# Altium schematic sheet USB_UART.SchDoc
size A4; SheetNumber: 7; SheetTotal: 7
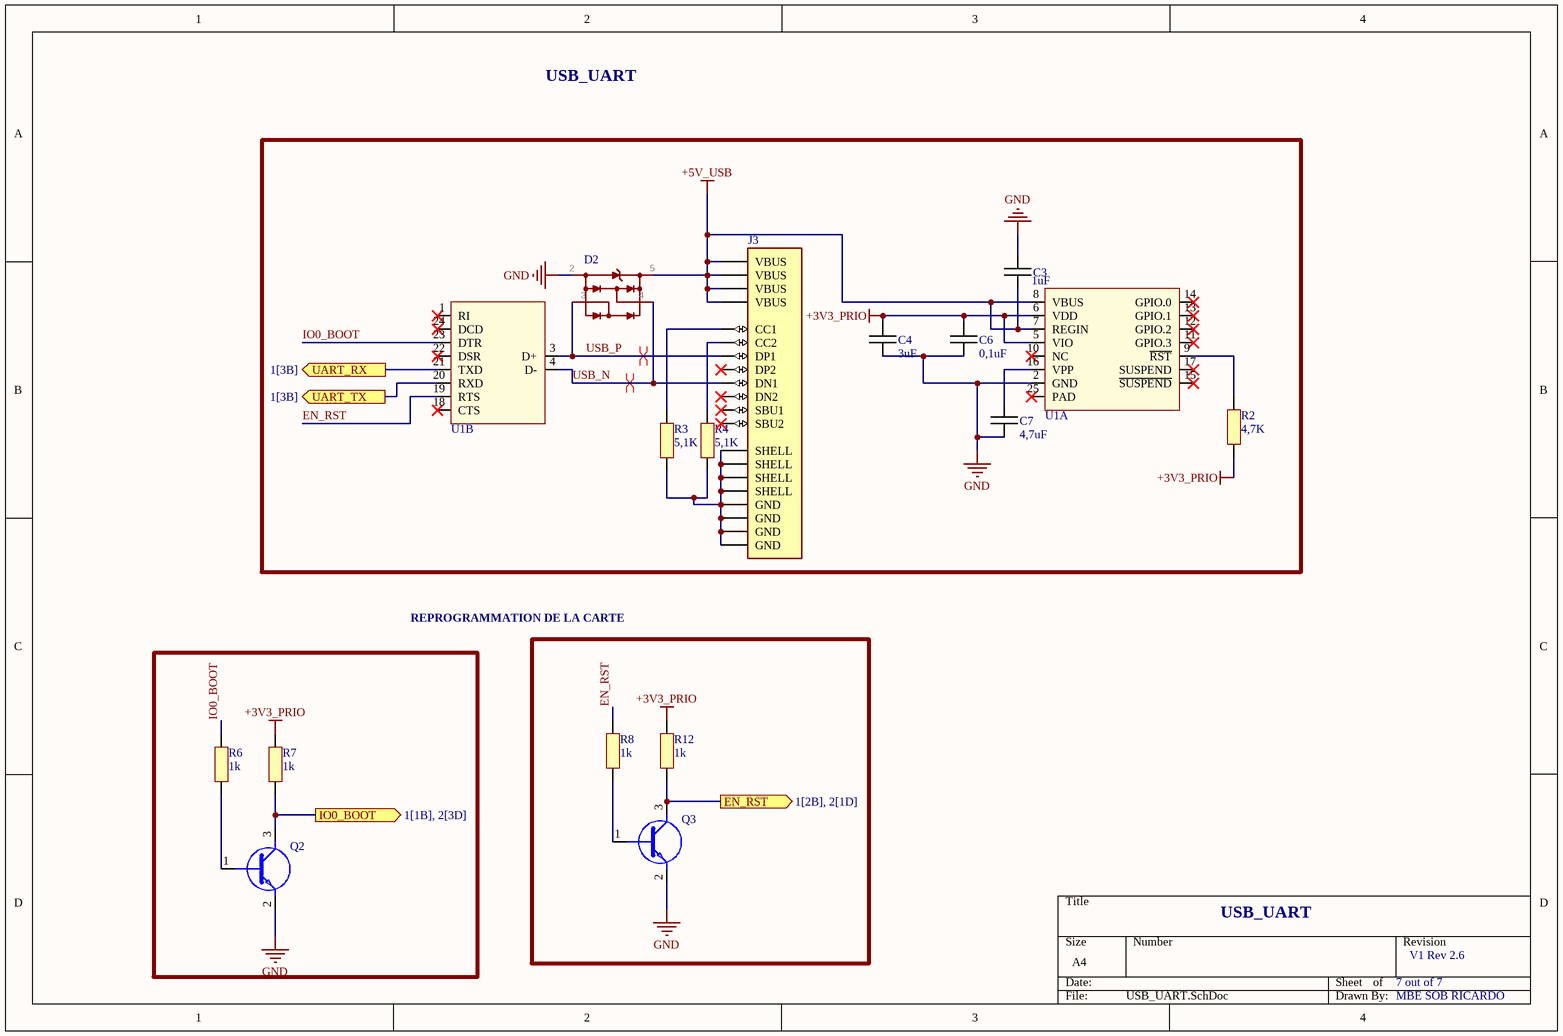
[diagram p0: USB_UART.SchDoc]

## Parts
C3  1uF  [CAPC1005X06N]
C4  3uF  [CAPC1005X06N]
C6  0,1uF  [CAPC1005X06N]
C7  4,7uF  [CAPC1005X06N]
D2  824011  [824011]  (value not drawn)
J3  Use  [USB4085-GF-A]  (value not drawn)
Q2  SS8050-G  [SS8050-G]  (value not drawn)
Q3  SS8050-G  [SS8050-G]  (value not drawn)
R2  4,7K  [RESC1005X06N]
R3  5,1K  [RESC1005X06N]
R4  5,1K  [RESC1005X06N]
R6  1k  [RESC1005X06N]
R7  1k  [RESC1005X06N]
R8  1k  [RESC1005X06N]
R12  1k  [RESC1005X06N]
U1  CP2104-F03-GM  [PQFN50P400X400X80_HS-25N]  (value not drawn)  (parts A,B of 2)

## Ports
EN_RST (out, see 1[2B], 2[1D]), IO0_BOOT (out, see 1[1B], 2[3D]), UART_RX (out, see 1[3B]), UART_TX (out, see 1[3B])

## Nets
+3V3_PRIO: C4.1 C6.1 R2.2 R7.1 R12.1 U1.5(VIO) U1.6(VDD)
+5V_USB: C3.2 D2.5(VDD) J3.A4(VBUS) J3.A9(VBUS) J3.B4(VBUS) J3.B9(VBUS) U1.7(REGIN) U1.8(VBUS)
GND: C3.1 C4.2 C6.2 C7.2 D2.2(GND) Q2.2(E) Q3.2(E) U1.2(GND)
EN_RST: R8.1 U1.19(RTS)
EN_RST: Q3.3(C) R12.2 ; port EN_RST  [a separate net that carries the same name]
IO0_BOOT: R6.1 U1.23(DTR)
IO0_BOOT: Q2.3(C) R7.2 ; port IO0_BOOT  [a separate net that carries the same name]
UART_RX: U1.21(TXD) ; port UART_RX
UART_TX: U1.20(RXD) ; port UART_TX
USB_N: D2.4 J3.A7(DN1) U1.4(D-)
USB_P: D2.3 J3.A6(DP1) U1.3(D+)
NetC7_1: C7.1 U1.16(VPP)
NetJ3_A1: J3.A1(GND) J3.A12(GND) J3.B1(GND) J3.B12(GND) J3.S1(SHELL) J3.S2(SHELL) J3.S3(SHELL) J3.S4(SHELL) R3.2 R4.2
NetJ3_A5: J3.A5(CC1) R3.1
NetJ3_B5: J3.B5(CC2) R4.1
NetQ2_1: Q2.1(B) R6.2
NetQ3_1: Q3.1(B) R8.2
NetR2_1: R2.1 U1.9(~{RST})

Not connected (* = marked no-connect by the designer): J3 A8(SBU1)* B6(DP2)* B7(DN2)* B8(SBU2)*; U1 1(RI)* 10(NC)* 11(GPIO.3)* 12(GPIO.2)* 13(GPIO.1)* 14(GPIO.0)* 15(~{SUSPEND})* 17(SUSPEND)* 18(CTS)* 22(DSR)* 24(DCD)* 25(PAD)*

## Layout directives
differential pair: USB_N, USB_P

## Notes on the sheet
- USB_UART
- REPROGRAMMATION DE LA CARTE
- 7 out of 7
- V1 Rev 2.6
- MBE SOB RICARDO

## Library data of the parts
C3 C4 C6 C7 = Capacitor
D2 = 824011: TVS Diode Array WE-TVS, High Speed Series  - Low capazity - No leakage current - Low clamping voltage - high ESD voltage protection  -- USB 1.0 - 2.0
J3 = USB4085-GF-A: Connecteurs USB USB Type C, 2.0, Rec, TH , G/F, RA , Top Mnt, T & R
Q2 Q3 = SS8050-G: Bipolar Transistors - BJT NPN TRANSISTOR 1.5A 40V
R2-R4 R6-R8 R12 = Resistor
U1 = USBBridge: USB Bridge, USB to UART USB 2.0 UART Interface 24-QFN (4x4); Manufacturer 1: Silicon Labs; Supplier 1: Arrow Electronics; Supplier Part Number 1: CP2104-F03-GM; Manufacturer Part Number 1: CP2104-F03-GM